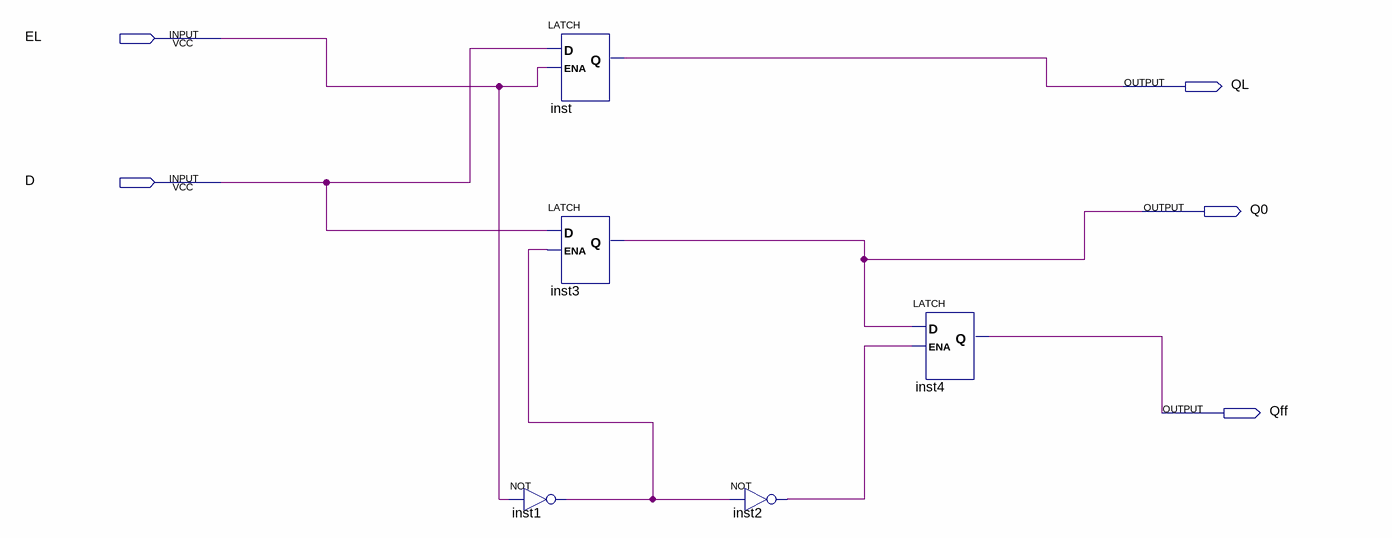
[diagram p0: schematic sheet]
// Quartus schematic Bascule.bdf as structural Verilog: 5 symbols, 5 pins
module Bascule (
  input  EL,
  input  D,
  output QL,
  output Q0,
  output Qff
);

  wire inst1_out, inst2_out;

  LATCH inst (.D(D), .ENA(EL), .Q(QL));
  LATCH inst3 (.D(D), .ENA(inst1_out), .Q(Q0));
  not inst1 (inst1_out, EL);
  not inst2 (inst2_out, inst1_out);
  LATCH inst4 (.D(Q0), .ENA(inst2_out), .Q(Qff));
endmodule
